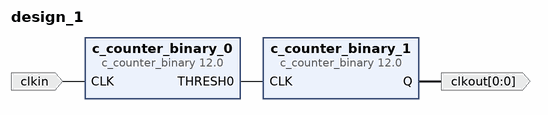
[diagram p0: block diagram of the top level]
# Vivado block design design_1, Vivado 2015.4
create_bd_design design_1

create_bd_port -dir I clkin
create_bd_port -dir O -from 0 -to 0 clkout

create_bd_cell -type ip -vlnv xilinx.com:ip:c_counter_binary:12.0 c_counter_binary_0
set_property -dict [list \
  CONFIG.Output_Width 25 \
  CONFIG.Restrict_Count true \
  CONFIG.Final_Count_Value 17D7840 \
  CONFIG.Sync_Threshold_Output true \
  CONFIG.Threshold_Value 17D7840 \
  CONFIG.Load false \
] [get_bd_cells c_counter_binary_0]
create_bd_cell -type ip -vlnv xilinx.com:ip:c_counter_binary:12.0 c_counter_binary_1
set_property -dict {CONFIG.Output_Width 1} [get_bd_cells c_counter_binary_1]

# ---- connections ----

connect_bd_net [get_bd_ports clkin] [get_bd_pins c_counter_binary_0/CLK]
connect_bd_net [get_bd_pins c_counter_binary_0/THRESH0] [get_bd_pins c_counter_binary_1/CLK]
connect_bd_net [get_bd_pins c_counter_binary_1/Q] [get_bd_ports clkout]

validate_bd_design
save_bd_design
